# EasyEDA Pro project ProPrj_ch32v305_pico.epro, schematic 40low_CH32V305_KS33_4

## Sheets
1 Keyboard: Board Name: 40low_CH32V305_RightWing; Create Date: 2026-09-10; Page Name: Keyboard; Project Name: #第11届立创电赛#CH32V305 pico USBHS开发板; Schematic Name: 40low_CH32V305_KS33_4; Update Date: 2026-09-10; Company: 嘉立创EDA; Page Size: A3; Version: V1.0
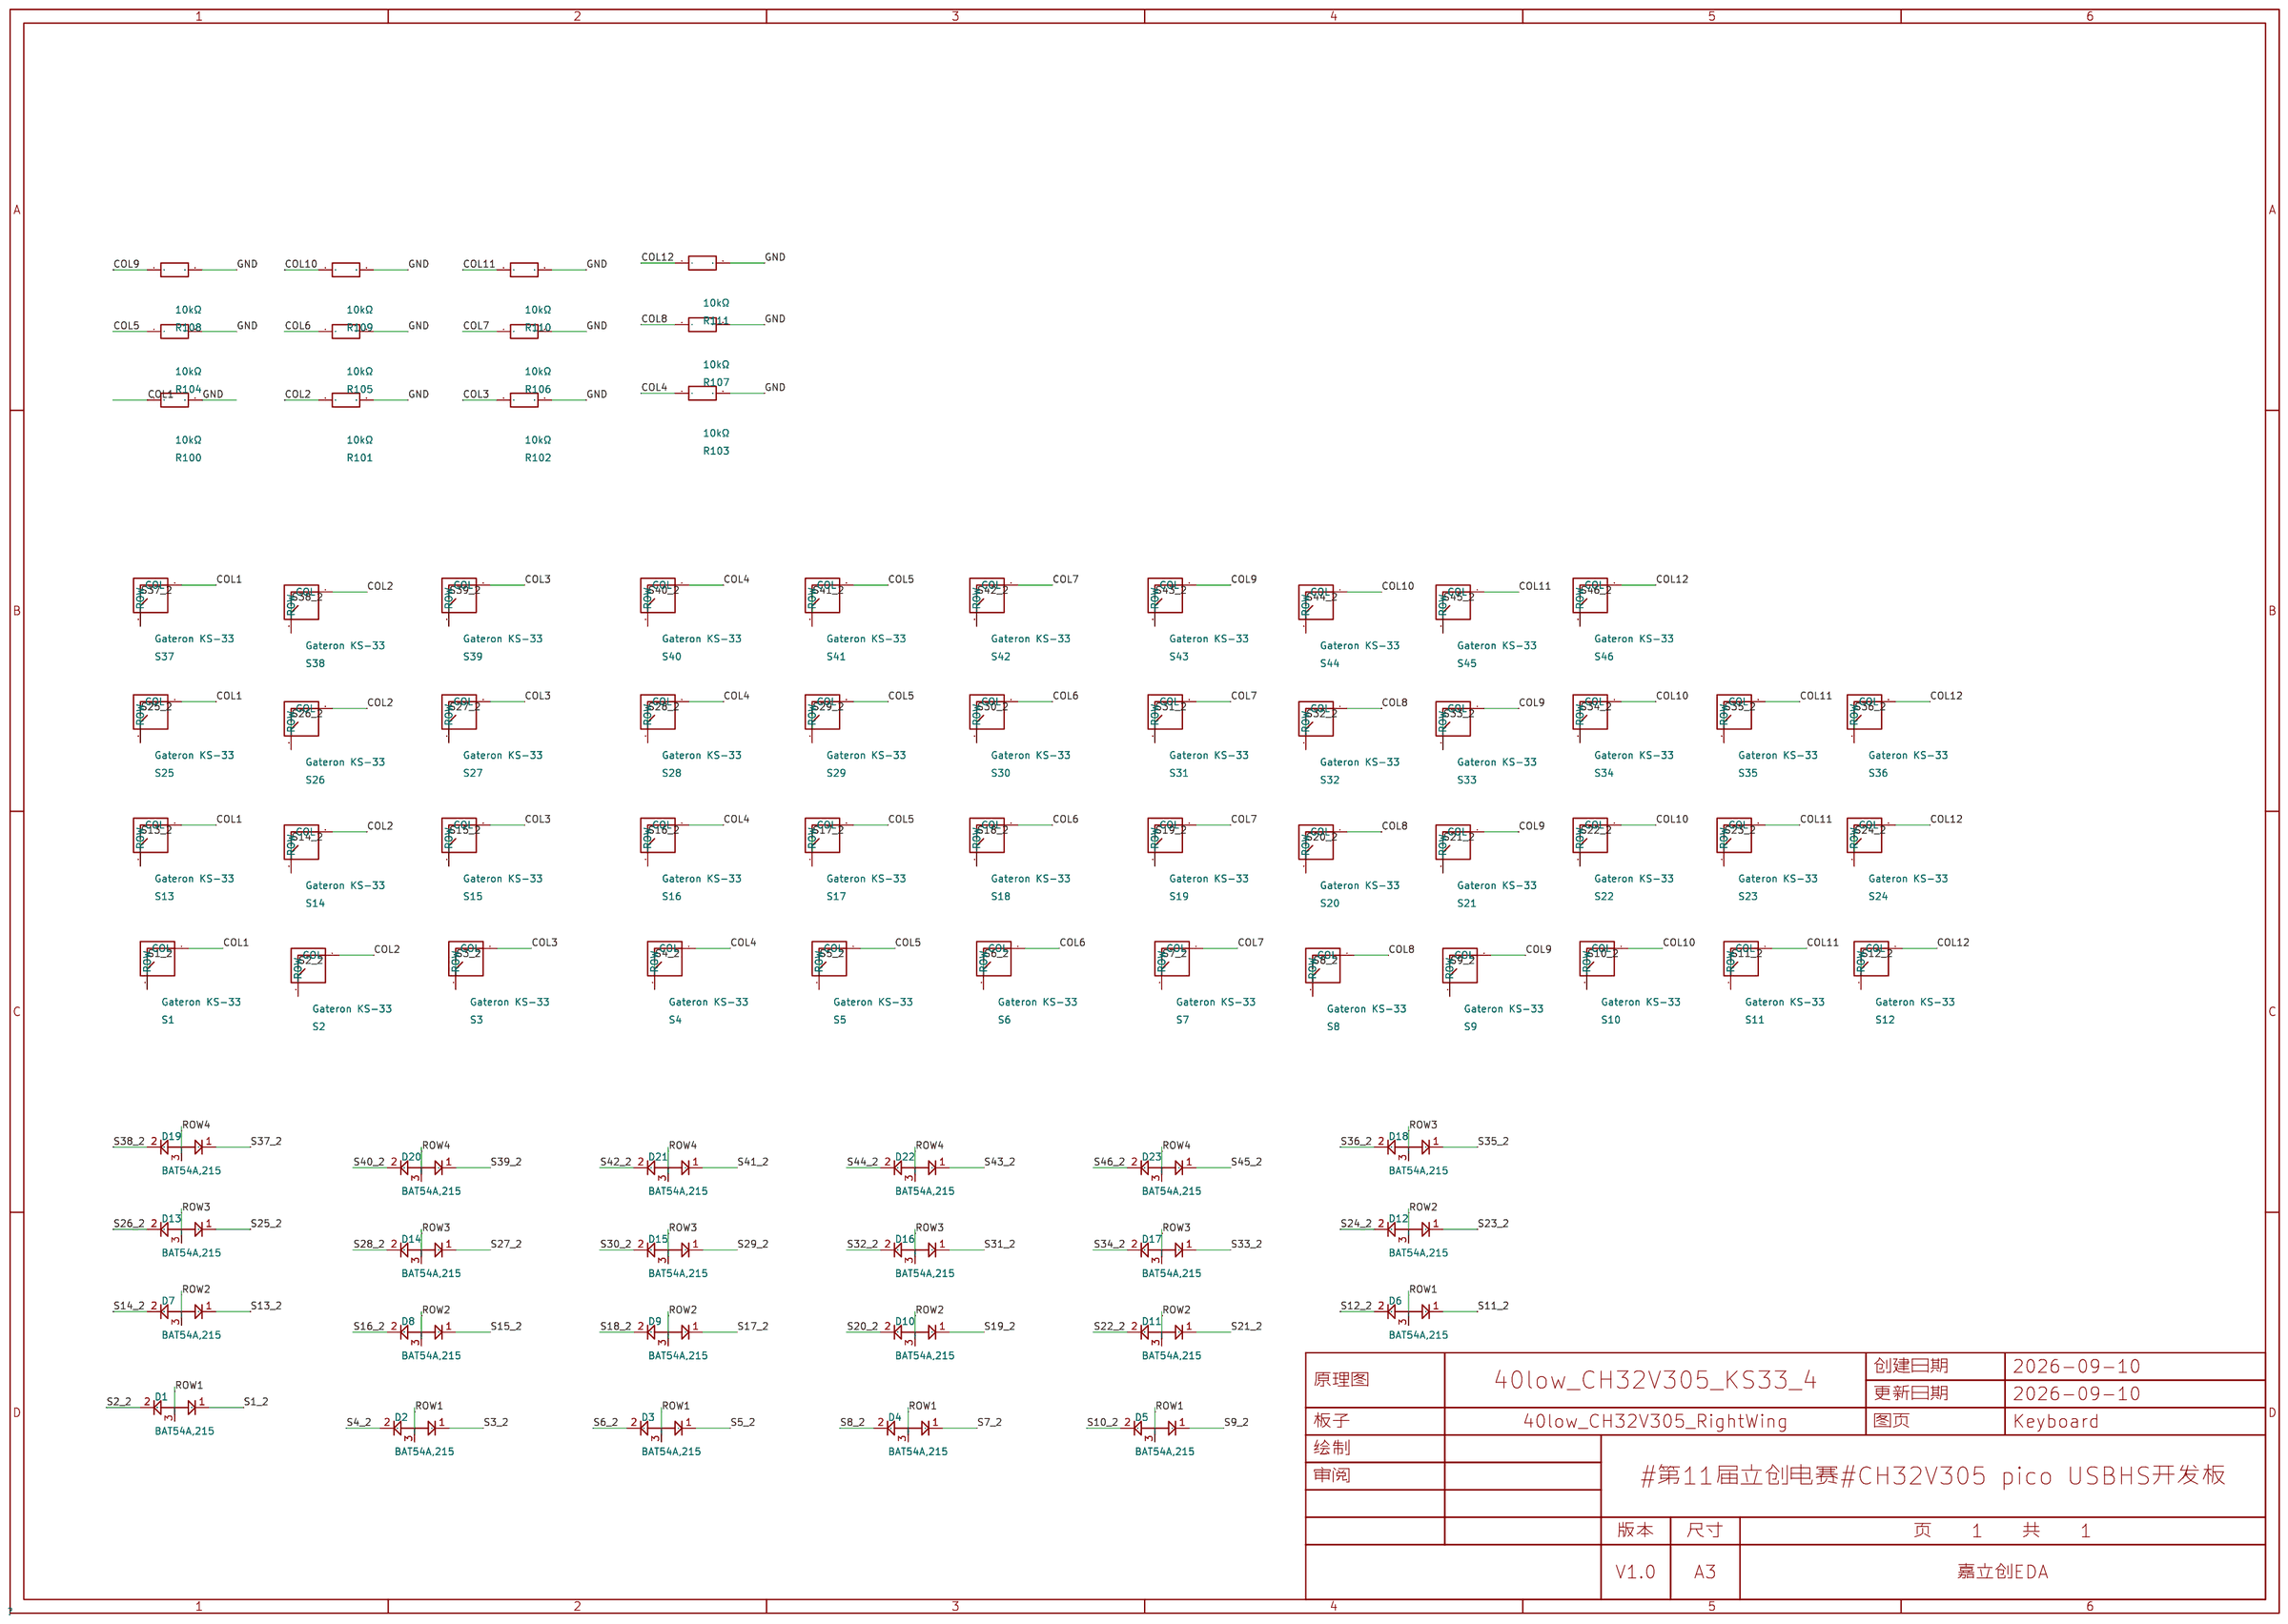
[diagram p0: Keyboard]
2 MCU: Assembly Variant: Basic; Page Name: P1; Page Size: A4
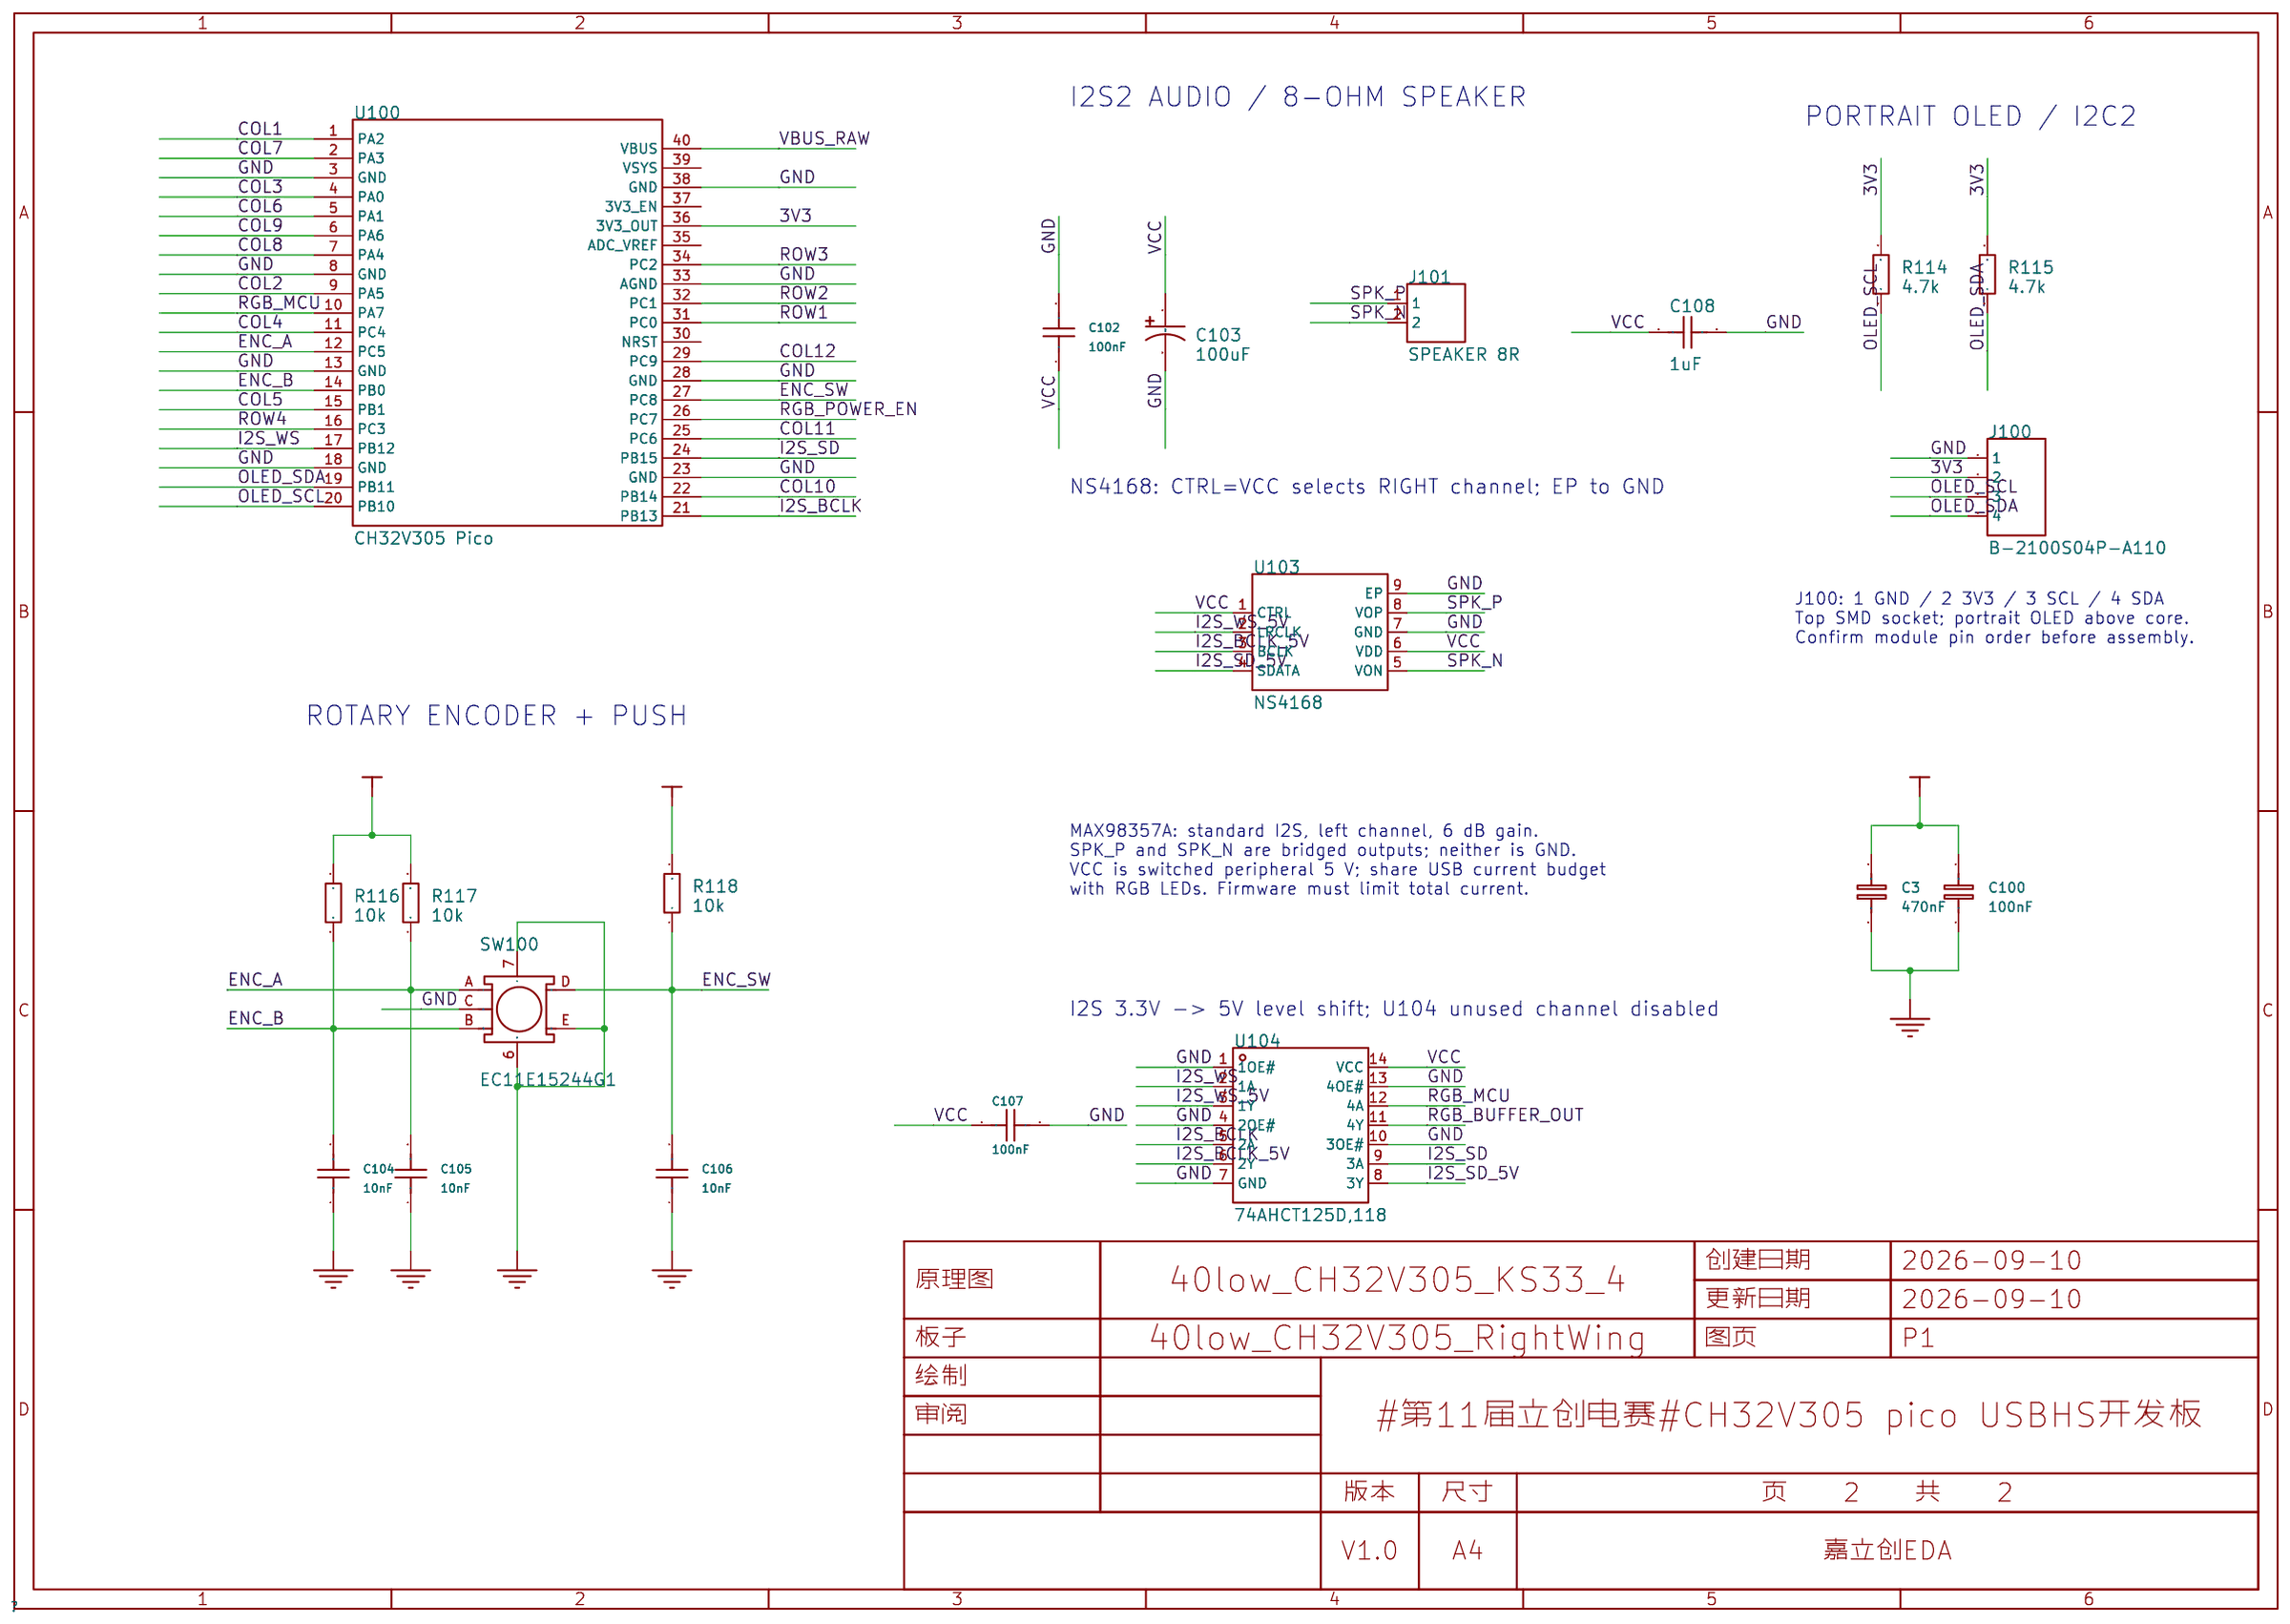
[diagram p1: MCU]
3 LED: Page Name: LED
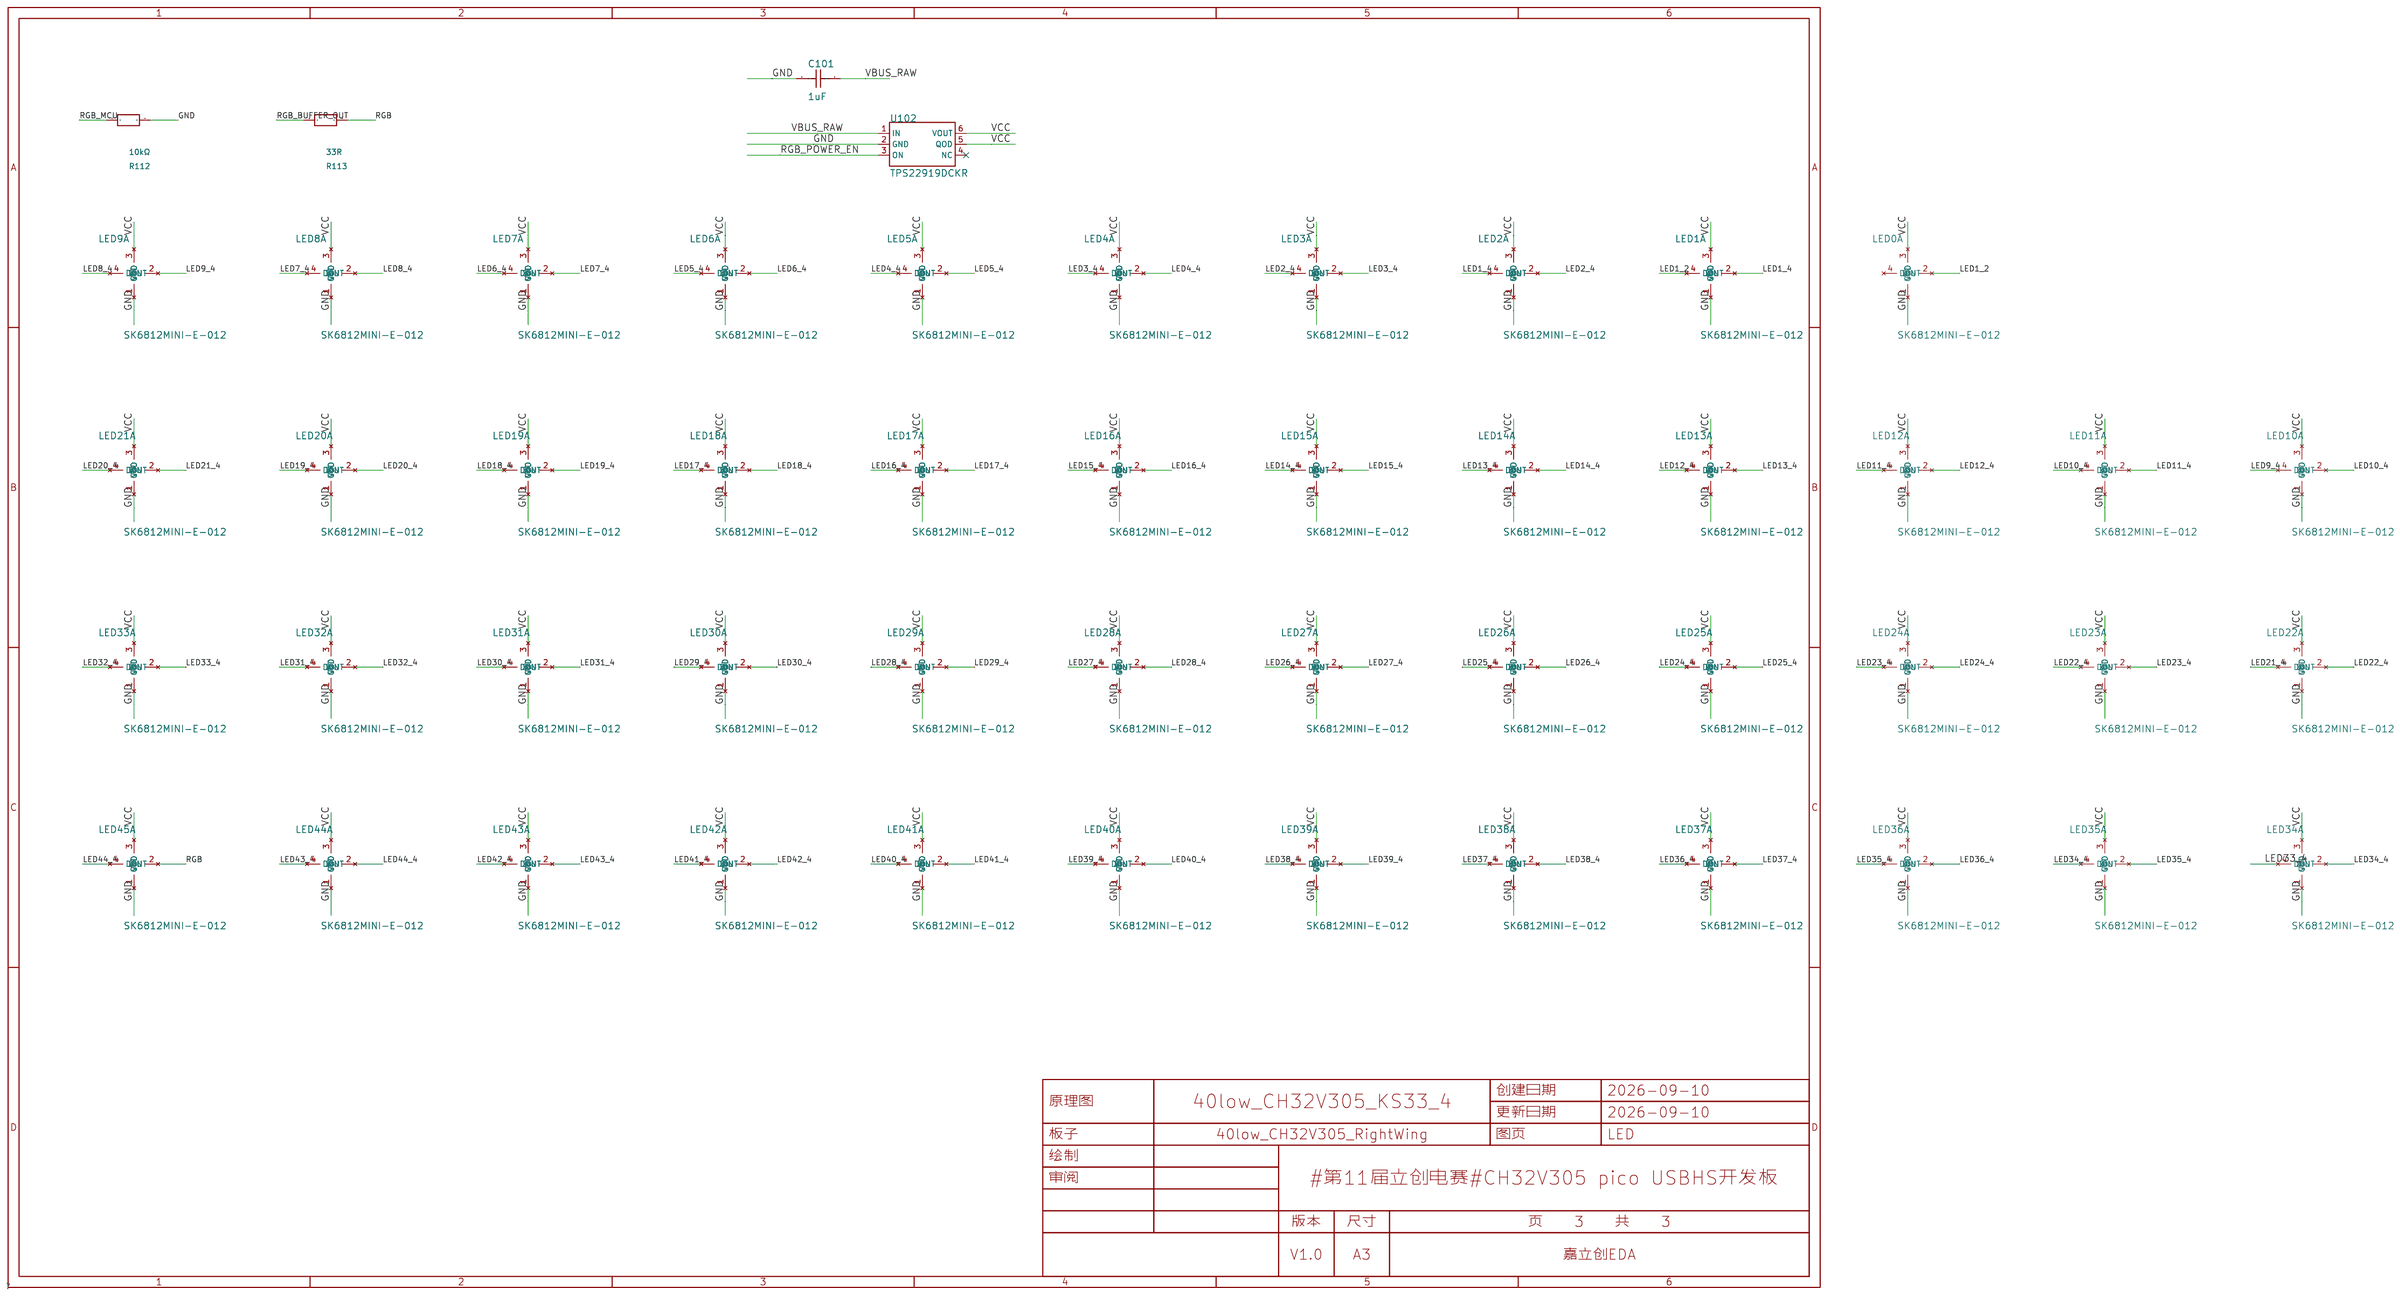
[diagram p2: LED]

## Parts
sheet Keyboard
D1  BAT54A,215  [SOT-23-3]
D2  BAT54A,215  [SOT-23-3]
D3  BAT54A,215  [SOT-23-3]
D4  BAT54A,215  [SOT-23-3]
D5  BAT54A,215  [SOT-23-3]
D6  BAT54A,215  [SOT-23-3]
D7  BAT54A,215  [SOT-23-3]
D8  BAT54A,215  [SOT-23-3]
D9  BAT54A,215  [SOT-23-3]
D10  BAT54A,215  [SOT-23-3]
D11  BAT54A,215  [SOT-23-3]
D12  BAT54A,215  [SOT-23-3]
D13  BAT54A,215  [SOT-23-3]
D14  BAT54A,215  [SOT-23-3]
D15  BAT54A,215  [SOT-23-3]
D16  BAT54A,215  [SOT-23-3]
D17  BAT54A,215  [SOT-23-3]
D18  BAT54A,215  [SOT-23-3]
D19  BAT54A,215  [SOT-23-3]
D20  BAT54A,215  [SOT-23-3]
D21  BAT54A,215  [SOT-23-3]
D22  BAT54A,215  [SOT-23-3]
D23  BAT54A,215  [SOT-23-3]
R100  10kΩ  [R0603]
R101  10kΩ  [R0603]
R102  10kΩ  [R0603]
R103  10kΩ  [R0603]
R104  10kΩ  [R0603]
R105  10kΩ  [R0603]
R106  10kΩ  [R0603]
R107  10kΩ  [R0603]
R108  10kΩ  [R0603]
R109  10kΩ  [R0603]
R110  10kΩ  [R0603]
R111  10kΩ  [R0603]
S1  Gateron KS-33  [40low_KS33_Solder_KeepCentre6p1]
S2  Gateron KS-33  [40low_KS33_Solder_KeepCentre6p1]
S3  Gateron KS-33  [40low_KS33_Solder_KeepCentre6p1]
S4  Gateron KS-33  [40low_KS33_Solder_KeepCentre6p1]
S5  Gateron KS-33  [40low_KS33_Solder_KeepCentre6p1]
S6  Gateron KS-33  [40low_KS33_Solder_KeepCentre6p1]
S7  Gateron KS-33  [40low_KS33_Solder_KeepCentre6p1]
S8  Gateron KS-33  [40low_KS33_Solder_KeepCentre6p1]
S9  Gateron KS-33  [40low_KS33_Solder_KeepCentre6p1]
S10  Gateron KS-33  [40low_KS33_Solder_KeepCentre6p1]
S11  Gateron KS-33  [40low_KS33_Solder_KeepCentre6p1]
S12  Gateron KS-33  [40low_KS33_Solder_KeepCentre6p1]
S13  Gateron KS-33  [40low_KS33_Solder_KeepCentre6p1]
S14  Gateron KS-33  [40low_KS33_Solder_KeepCentre6p1]
S15  Gateron KS-33  [40low_KS33_Solder_KeepCentre6p1]
S16  Gateron KS-33  [40low_KS33_Solder_KeepCentre6p1]
S17  Gateron KS-33  [40low_KS33_Solder_KeepCentre6p1]
S18  Gateron KS-33  [40low_KS33_Solder_KeepCentre6p1]
S19  Gateron KS-33  [40low_KS33_Solder_KeepCentre6p1]
S20  Gateron KS-33  [40low_KS33_Solder_KeepCentre6p1]
S21  Gateron KS-33  [40low_KS33_Solder_KeepCentre6p1]
S22  Gateron KS-33  [40low_KS33_Solder_KeepCentre6p1]
S23  Gateron KS-33  [40low_KS33_Solder_KeepCentre6p1]
S24  Gateron KS-33  [40low_KS33_Solder_KeepCentre6p1]
S25  Gateron KS-33  [40low_KS33_Solder_KeepCentre6p1]
S26  Gateron KS-33  [40low_KS33_Solder_KeepCentre6p1]
S27  Gateron KS-33  [40low_KS33_Solder_KeepCentre6p1]
S28  Gateron KS-33  [40low_KS33_Solder_KeepCentre6p1]
S29  Gateron KS-33  [40low_KS33_Solder_KeepCentre6p1]
S30  Gateron KS-33  [40low_KS33_Solder_KeepCentre6p1]
S31  Gateron KS-33  [40low_KS33_Solder_KeepCentre6p1]
S32  Gateron KS-33  [40low_KS33_Solder_KeepCentre6p1]
S33  Gateron KS-33  [40low_KS33_Solder_KeepCentre6p1]
S34  Gateron KS-33  [40low_KS33_Solder_KeepCentre6p1]
S35  Gateron KS-33  [40low_KS33_Solder_KeepCentre6p1]
S36  Gateron KS-33  [40low_KS33_Solder_KeepCentre6p1]
S37  Gateron KS-33  [40low_KS33_Solder_KeepCentre6p1]
S38  Gateron KS-33  [40low_KS33_Solder_KeepCentre6p1]
S39  Gateron KS-33  [40low_KS33_Solder_KeepCentre6p1]
S40  Gateron KS-33  [40low_KS33_Solder_KeepCentre6p1]
S41  Gateron KS-33  [40low_KS33_Solder_KeepCentre6p1]
S42  Gateron KS-33  [40low_KS33_Solder_KeepCentre6p1]
S43  Gateron KS-33  [40low_KS33_Solder_KeepCentre6p1]
S44  Gateron KS-33  [40low_KS33_Solder_KeepCentre6p1]
S45  Gateron KS-33  [40low_KS33_Solder_KeepCentre6p1]
S46  Gateron KS-33  [40low_KS33_Solder_KeepCentre6p1]
sheet LED
C101  1uF  [C0603]
LED0  SK6812MINI-E-012  [reverse-led-candidate]  (section 1)
LED1  SK6812MINI-E-012  [reverse-led-candidate]  (section 1)
LED2  SK6812MINI-E-012  [reverse-led-candidate]  (section 1)
LED3  SK6812MINI-E-012  [reverse-led-candidate]  (section 1)
LED4  SK6812MINI-E-012  [reverse-led-candidate]  (section 1)
LED5  SK6812MINI-E-012  [reverse-led-candidate]  (section 1)
LED6  SK6812MINI-E-012  [reverse-led-candidate]  (section 1)
LED7  SK6812MINI-E-012  [reverse-led-candidate]  (section 1)
LED8  SK6812MINI-E-012  [reverse-led-candidate]  (section 1)
LED9  SK6812MINI-E-012  [reverse-led-candidate]  (section 1)
LED10  SK6812MINI-E-012  [reverse-led-candidate]  (section 1)
LED11  SK6812MINI-E-012  [reverse-led-candidate]  (section 1)
LED12  SK6812MINI-E-012  [reverse-led-candidate]  (section 1)
LED13  SK6812MINI-E-012  [reverse-led-candidate]  (section 1)
LED14  SK6812MINI-E-012  [reverse-led-candidate]  (section 1)
LED15  SK6812MINI-E-012  [reverse-led-candidate]  (section 1)
LED16  SK6812MINI-E-012  [reverse-led-candidate]  (section 1)
LED17  SK6812MINI-E-012  [reverse-led-candidate]  (section 1)
LED18  SK6812MINI-E-012  [reverse-led-candidate]  (section 1)
LED19  SK6812MINI-E-012  [reverse-led-candidate]  (section 1)
LED20  SK6812MINI-E-012  [reverse-led-candidate]  (section 1)
LED21  SK6812MINI-E-012  [reverse-led-candidate]  (section 1)
LED22  SK6812MINI-E-012  [reverse-led-candidate]  (section 1)
LED23  SK6812MINI-E-012  [reverse-led-candidate]  (section 1)
LED24  SK6812MINI-E-012  [reverse-led-candidate]  (section 1)
LED25  SK6812MINI-E-012  [reverse-led-candidate]  (section 1)
LED26  SK6812MINI-E-012  [reverse-led-candidate]  (section 1)
LED27  SK6812MINI-E-012  [reverse-led-candidate]  (section 1)
LED28  SK6812MINI-E-012  [reverse-led-candidate]  (section 1)
LED29  SK6812MINI-E-012  [reverse-led-candidate]  (section 1)
LED30  SK6812MINI-E-012  [reverse-led-candidate]  (section 1)
LED31  SK6812MINI-E-012  [reverse-led-candidate]  (section 1)
LED32  SK6812MINI-E-012  [reverse-led-candidate]  (section 1)
LED33  SK6812MINI-E-012  [reverse-led-candidate]  (section 1)
LED34  SK6812MINI-E-012  [reverse-led-candidate]  (section 1)
LED35  SK6812MINI-E-012  [reverse-led-candidate]  (section 1)
LED36  SK6812MINI-E-012  [reverse-led-candidate]  (section 1)
LED37  SK6812MINI-E-012  [reverse-led-candidate]  (section 1)
LED38  SK6812MINI-E-012  [reverse-led-candidate]  (section 1)
LED39  SK6812MINI-E-012  [reverse-led-candidate]  (section 1)
LED40  SK6812MINI-E-012  [reverse-led-candidate]  (section 1)
LED41  SK6812MINI-E-012  [reverse-led-candidate]  (section 1)
LED42  SK6812MINI-E-012  [reverse-led-candidate]  (section 1)
LED43  SK6812MINI-E-012  [reverse-led-candidate]  (section 1)
LED44  SK6812MINI-E-012  [reverse-led-candidate]  (section 1)
LED45  SK6812MINI-E-012  [reverse-led-candidate]  (section 1)
R112  10kΩ  [R0603]
R113  33R  [0603]
U102  TPS22919DCKR  [SC-70-6_L2.2-W1.3-P0.65-LS2.1-BR]
sheet MCU
C3  470nF  [C0603]
C100  100nF  [C0603]
C102  100nF  [C0603]
C103  100uF  [CAP-SMD_BD5.0-L5.3-W5.3-LS6.3-FD]
C104  10nF  [C0603]
C105  10nF  [C0603]
C106  10nF  [C0603]
C107  100nF  [C0603]
C108  1uF  [C0603]
J100  B-2100S04P-A110  [HDR-TH_4P-P2.54-V-M]
J101  SPEAKER 8R  [HDR-TH_2P-P2.54-V-M-1]
R114  4.7kΩ  [R0603]
R115  4.7kΩ  [R0603]
R116  10kΩ  [R0603]
R117  10kΩ  [R0603]
R118  10kΩ  [R0603]
SW100  EC11E15244G1  [SW-TH_EC11E15244G1]
U100  CH32V305 Pico  [CH32V305_Pico_Castellated_40]
U103  NS4168  [ESOP-8_L4.9-W3.9-P1.27-LS6.0-BL-EP]
U104  74AHCT125D,118  [SOP-14_L8.6-W3.9-P1.27-LS6.0-BL]

## Library data of the parts
D1-D23 = MMBD4148: Dual common-anode Schottky diode; pin 3 A1/A2, pin 1 K1, pin 2 K2; SOT-23; Origin 3D Model Title: SOT-23-3L_L2.9-W1.6-H1.1-LS2.8-P0.95; Manufacturer: Nexperia(安世); Supplier: LCSC; Supplier Part: C130910; Datasheet: https://assets.nexperia.com/documents/data-sheet/BAT54A.pdf
R100-R112 R116-R118 = 0603WAF1002T5E: 电阻类型:厚膜电阻;阻值:10kΩ;精度:±1%;功率:100mW;工作电压:75V;温度系数:±100ppm/℃;; LCSC Part Name: 厚膜电阻 10kΩ ±1% 100mW; Supplier Part: C25804; Manufacturer: UNI-ROYAL(厚声); Supplier Footprint: 0603; JLCPCB Part Class: Basic Part; Datasheet: https://item.szlcsc.com/datasheet/0603WAF1002T5E/26547.html; Supplier: LCSC; Type: 厚膜电阻; Tolerance: ±1%; Power(Watts): 100mW; Voltage-Supply(Max): 75V; Temperature Coefficient: ±100ppm/℃; Operating Temperature: -55℃~+155℃
S1-S46 = Gateron KS-33 solder (40low)
C101 C108 = CL10A105KB8NNNC: 容值:1uF;精度:±10%;额定电压:50V;温度系数:X5R;; LCSC Part Name: 1uF ±10% 50V; Supplier Part: C15849; Manufacturer: SAMSUNG(三星); Supplier Footprint: 0603; JLCPCB Part Class: Basic Part; Datasheet: https://item.szlcsc.com/datasheet/CL10A105KB8NNNC/16531.html; Supplier: LCSC; Tolerance: ±10%; Voltage Rating: 50V; Temperature Coefficient: X5R
LED0-LED45 = SK6812MINI_E_012_40low: OPSCO SK6812MINI-E-012 reverse LED; 1 GND, 2 DIN, 3 VDD, 4 DOUT; Manufacturer: OPSCO; Supplier: LCSC; Supplier Part: C5149201
R113 = 33R 0603: 0603 generic; choose matching rated part before BOM release.
U102 = TPS22919DCKR: 类型:负载开关;通道数:1;输入控制逻辑:高电平有效;最大连续电流:1.5A;工作电压:1.6V~5.5V;导通电阻:89mΩ;; LCSC Part Name: 具有受控上升时间的5.5V、1.5A、90mΩ自保护负载开关; Supplier Part: C2149796; Manufacturer: Texas Instruments; Supplier Footprint: SC-70-6; JLCPCB Part Class: Extended Part; Datasheet: https://www.ti.com/cn/lit/gpn/tps22919; Supplier: LCSC; Type: 负载开关; Number of Channels: 1; Control Input Logic: 高电平有效; Maximum Continuous Current: 1.5A; Voltage - Supply: 1.6V~5.5V; RDS(on): 89mΩ; Operating Temperature	-: -40℃~+125℃; Features: 过热保护(OTP)；短路保护(SCP)
C3 = CL10B474KO8NNNC: 容值:470nF;精度:±10%;额定电压:16V;温度系数:X7R;; LCSC Part Name: 470nF ±10% 16V; Supplier Part: C105526; Manufacturer: SAMSUNG(三星); Supplier Footprint: 0603; JLCPCB Part Class: Extended Part; Datasheet: https://item.szlcsc.com/datasheet/CL10B474KO8NNNC/106741.html; Supplier: LCSC; Tolerance: ±10%; Voltage Rating: 16V; Temperature Coefficient: X7R
C100 C102 C107 = CC0603KRX7R9BB104: 容值:100nF;精度:±10%;额定电压:50V;温度系数:X7R;; LCSC Part Name: 100nF ±10% 50V; Supplier Part: C14663; Manufacturer: YAGEO(国巨); Supplier Footprint: 0603; JLCPCB Part Class: Basic Part; Datasheet: https://item.szlcsc.com/datasheet/CC0603KRX7R9BB104/15331.html; Supplier: LCSC; Tolerance: ±10%; Voltage Rating: 50V; Temperature Coefficient: X7R
C103 = VT1A101M0505: 容值:100uF;精度:±20%;额定电压:10V;纹波电流:40mA@120Hz;等效串联电阻(ESR):-;; LCSC Part Name: 100uF ±20% 10V; Supplier Part: C191859; Manufacturer: ROQANG(容强); Supplier Footprint: SMD,D5xL5.4mm; JLCPCB Part Class: Extended Part; Datasheet: https://atta.szlcsc.com/upload/public/pdf/source/20180502/C191859_5B846418F1FC4C14CCCE0409874E2ED6.pdf; Supplier: LCSC; Tolerance: ±20%; Voltage Rating: 10V; Ripple Current: 40mA@120Hz; Diameter: 5mm; Height - Seated (Max): 5.4mm; Lifetime: 2000hrs@105℃; Operating Temperature: -40℃~+105℃
C104-C106 = 0603B103K500NT: 容值:10nF;精度:±10%;额定电压:50V;温度系数:X7R;; LCSC Part Name: 10nF ±10% 50V; Supplier Part: C57112; Manufacturer: FH(风华); Supplier Footprint: 0603; JLCPCB Part Class: Basic Part; Datasheet: https://item.szlcsc.com/datasheet/0603B103K500NT/58143.html; Supplier: LCSC; Tolerance: ±10%; Voltage Rating: 50V; Temperature Coefficient: X7R
J100 = B-2100S04P-A110: 插针结构:1x4P;间距:2.54mm;行距:-;圆针/方针:方针;安装方式:直插;排数:单排;总PIN位数:4P;额定电流:3A;额定电压:-;配合针长度:6mm;塑高:2.54mm;端接针长度:3mm;触头材质:黄铜;触头镀层:-;工作温度:-40℃~+105℃;颜色:黑色;; LCSC Part Name: 1x4P 间距:2.54mm 方针 直插; Supplier Part: C124378; Manufacturer: Ckmtw(灿科盟); Supplier Footprint: 插件,P=2.54mm; JLCPCB Part Class: Extended Part; Datasheet: https://item.szlcsc.com/datasheet/B-2100S04P-A110/125653.html; Supplier: LCSC; Pin Structure: 1x4P; Pitch: 2.54mm; Circluar Pins/Square Pins: 方针; Mounting Type: 直插; Number of Rows: 单排; Number of Pins: 4P; Current Rating: 3A; Length of Mating Pin: 6mm; Insulation Height: 2.54mm; Length of End Connection Pin: 3mm; Contact Material: 黄铜; Operating Temperature: -40℃~+105℃; Color: 黑色
J101 = B-2100S02P-A110: 插针结构:1x2P;间距:2.54mm;行距:-;圆针/方针:方针;安装方式:直插;排数:单排;总PIN位数:2P;额定电流:3A;额定电压:-;配合针长度:6mm;塑高:2.54mm;端接针长度:3mm;触头材质:黄铜;触头镀层:金;工作温度:-40℃~+105℃;颜色:黑色;; LCSC Part Name: 1x2P 间距:2.54mm 方针 直插; Supplier Part: C124375; Manufacturer: Ckmtw(灿科盟); Supplier Footprint: 插件,P=2.54mm; JLCPCB Part Class: Extended Part; Datasheet: https://item.szlcsc.com/datasheet/B-2100S02P-A110/125650.html; Supplier: LCSC; Pin Structure: 1x2P; Pitch: 2.54mm; Circluar Pins/Square Pins: 方针; Mounting Type: 直插; Number of Rows: 单排; Number of Pins: 2P; Current Rating: 3A; Length of Mating Pin: 6mm; Insulation Height: 2.54mm; Length of End Connection Pin: 3mm; Contact Material: 黄铜; Contact Plating: 金; Operating Temperature: -40℃~+105℃; Color: 黑色
R114 R115 = 0603WAF4701T5E: 电阻类型:厚膜电阻;阻值:4.7kΩ;精度:±1%;功率:100mW;工作电压:75V;温度系数:±100ppm/℃;; LCSC Part Name: 厚膜电阻 4.7kΩ ±1%; Supplier Part: C23162; Manufacturer: UNI-ROYAL(厚声); Supplier Footprint: 0603; JLCPCB Part Class: Basic Part; Datasheet: https://item.szlcsc.com/datasheet/0603WAF4701T5E/23889.html; Supplier: LCSC; Type: 厚膜电阻; Tolerance: ±1%; Power(Watts): 100mW; Voltage-Supply(Max): 75V; Temperature Coefficient: ±100ppm/℃; Operating Temperature: -55℃~+155℃
SW100 = EC11E15244G1: LCSC Part Name: 编码器; Supplier Part: C370970; Manufacturer: ALPSALPINE(阿尔卑斯阿尔派); Supplier Footprint: 插件; JLCPCB Part Class: Extended Part; Datasheet: https://item.szlcsc.com/datasheet/EC11E15244G1/344654.html; Supplier: LCSC
U100 = CH32V305_Pico_Castellated_40_Module: CH32V305 Pico revision 2, 40 castellated SMD carrier contacts; Supplier Part: 48c9595067e55f20
U103 = NS4168_C910588: 功放类型:D类功放;扬声器通道数:单声道;输出功率:2.5Wx1@4Ω;静态电流(Iq):13mA;; LCSC Part Name: 2.5W-I2S数字输入单声道D类音频功率放大器; Supplier Part: C910588; Manufacturer: Nsiway(纳芯威); Supplier Footprint: ESOP-8-EP(3.9x4.9x1.27); JLCPCB Part Class: Extended Part; Datasheet: https://item.szlcsc.com/datasheet/NS4168/978904.html; Supplier: LCSC; Class: D类功放; Speaker Channels: 单声道; Output Power: 2.5Wx1@4Ω; Total Harmonic Distortion + Noise (THD+N): 0.2%; Quiescent Current: 13mA; Signal-to-Noise Ratio: 85dB; Power Supply Rejection Ratio (PSRR): -80dB; Efficiency: 80%; Features: 无滤波器架构；使能/关断功能；自动静音/免噪音开关；内置音频处理；可配置输出拓扑; Voltage - Supply: 3V~5.5V
U104 = 74AHCT125D,118: 输入类型:施密特触发器;工作电压:4.5V~5.5V;元件数:4;每个元件位数:1;灌电流(IOL):8mA;拉电流(IOH):8mA;; LCSC Part Name: 三态输出，四路缓冲器/线路驱动器; Supplier Part: C554502; Manufacturer: Nexperia(安世); Supplier Footprint: SOP-14; JLCPCB Part Class: Extended Part; Datasheet: https://item.szlcsc.com/datasheet/74AHCT125D%252C118/575616.html; Supplier: LCSC; Input type: 施密特触发器; output type: 三态; Voltage - Supply: 4.5V~5.5V; Number of Elements: 4; Number of Bits per Element: 1; Channel Type: 单向; Current - Output Low(IOL): 8mA; Current - Output High(IOH): 8mA; Logic Family: 74AHCT; Operating Temperature: -40℃~+125℃; Quiescent Current: 40uA; Propagation Delay: 4.3ns@5V,50pF

## Nets
3V3: J100.2 R114.2 R115.2 R116.1 R117.2 R118.2 U100.36(3V3_OUT)
GND: C3.2 C100.2 C101.1 C102.2 C103.2 C104.1 C105.1 C106.1 C107.2 C108.2 J100.1 LED0.1(GND) LED1.1(GND) LED2.1(GND) LED3.1(GND) LED4.1(GND) LED5.1(GND) LED6.1(GND) LED7.1(GND) LED8.1(GND) LED9.1(GND) LED10.1(GND) LED11.1(GND) LED12.1(GND) LED13.1(GND) LED14.1(GND) LED15.1(GND) LED16.1(GND) LED17.1(GND) LED18.1(GND) LED19.1(GND) LED20.1(GND) LED21.1(GND) LED22.1(GND) LED23.1(GND) LED24.1(GND) LED25.1(GND) LED26.1(GND) LED27.1(GND) LED28.1(GND) LED29.1(GND) LED30.1(GND) LED31.1(GND) LED32.1(GND) LED33.1(GND) LED34.1(GND) LED35.1(GND) LED36.1(GND) LED37.1(GND) LED38.1(GND) LED39.1(GND) LED40.1(GND) LED41.1(GND) LED42.1(GND) LED43.1(GND) LED44.1(GND) LED45.1(GND) R100.2 R101.2 R102.2 R103.2 R104.2 R105.2 R106.2 R107.2 R108.2 R109.2 R110.2 R111.2 R112.2 SW100.6 SW100.7 SW100.C SW100.E U100.3(GND) U100.8(GND) U100.13(GND) U100.18(GND) U100.23(GND) U100.28(GND) U100.33(AGND) U100.38(GND) U102.2(GND) U103.7(GND) U103.9(EP) U104.1(1OE#) U104.4(2OE#) U104.7(GND) U104.10(3OE#) U104.13(4OE#)
VBUS_RAW: C101.2 U100.40(VBUS) U102.1(IN)
VCC: C3.1 C100.1 C102.1 C103.1 C107.1 C108.1 LED0.3(VDD) LED1.3(VDD) LED2.3(VDD) LED3.3(VDD) LED4.3(VDD) LED5.3(VDD) LED6.3(VDD) LED7.3(VDD) LED8.3(VDD) LED9.3(VDD) LED10.3(VDD) LED11.3(VDD) LED12.3(VDD) LED13.3(VDD) LED14.3(VDD) LED15.3(VDD) LED16.3(VDD) LED17.3(VDD) LED18.3(VDD) LED19.3(VDD) LED20.3(VDD) LED21.3(VDD) LED22.3(VDD) LED23.3(VDD) LED24.3(VDD) LED25.3(VDD) LED26.3(VDD) LED27.3(VDD) LED28.3(VDD) LED29.3(VDD) LED30.3(VDD) LED31.3(VDD) LED32.3(VDD) LED33.3(VDD) LED34.3(VDD) LED35.3(VDD) LED36.3(VDD) LED37.3(VDD) LED38.3(VDD) LED39.3(VDD) LED40.3(VDD) LED41.3(VDD) LED42.3(VDD) LED43.3(VDD) LED44.3(VDD) LED45.3(VDD) U102.5(QOD) U102.6(VOUT) U103.1(CTRL) U103.6(VDD) U104.14(VCC)
COL1: R100.1 S1.1(COL) S13.1(COL) S25.1(COL) S37.1(COL) U100.1(PA2)
COL2: R101.1 S2.1(COL) S14.1(COL) S26.1(COL) S38.1(COL) U100.9(PA5)
COL3: R102.1 S3.1(COL) S15.1(COL) S27.1(COL) S39.1(COL) U100.4(PA0)
COL4: R103.1 S4.1(COL) S16.1(COL) S28.1(COL) S40.1(COL) U100.11(PC4)
COL5: R104.1 S5.1(COL) S17.1(COL) S29.1(COL) S41.1(COL) U100.15(PB1)
COL6: R105.1 S6.1(COL) S18.1(COL) S30.1(COL) U100.5(PA1)
COL7: R106.1 S7.1(COL) S19.1(COL) S31.1(COL) S42.1(COL) U100.2(PA3)
COL8: R107.1 S8.1(COL) S20.1(COL) S32.1(COL) U100.7(PA4)
COL9: R108.1 S9.1(COL) S21.1(COL) S33.1(COL) S43.1(COL) U100.6(PA6)
COL10: R109.1 S10.1(COL) S22.1(COL) S34.1(COL) S44.1(COL) U100.22(PB14)
COL11: R110.1 S11.1(COL) S23.1(COL) S35.1(COL) S45.1(COL) U100.25(PC6)
COL12: R111.1 S12.1(COL) S24.1(COL) S36.1(COL) S46.1(COL) U100.29(PC9)
ENC_A: C105.2 R117.1 SW100.A U100.12(PC5)
ENC_B: C104.2 R116.2 SW100.B U100.14(PB0)
ENC_SW: C106.2 R118.1 SW100.D U100.27(PC8)
I2S_BCLK: U100.21(PB13) U104.5(2A)
I2S_BCLK_5V: U103.3(BCLK) U104.6(2Y)
I2S_SD: U100.24(PB15) U104.9(3A)
I2S_SD_5V: U103.4(SDATA) U104.8(3Y)
I2S_WS: U100.17(PB12) U104.2(1A)
I2S_WS_5V: U103.2(LRCLK) U104.3(1Y)
LED1_2: LED0.2(DIN) LED1.4(DOUT)
LED1_4: LED1.2(DIN) LED2.4(DOUT)
LED2_4: LED2.2(DIN) LED3.4(DOUT)
LED3_4: LED3.2(DIN) LED4.4(DOUT)
LED4_4: LED4.2(DIN) LED5.4(DOUT)
LED5_4: LED5.2(DIN) LED6.4(DOUT)
LED6_4: LED6.2(DIN) LED7.4(DOUT)
LED7_4: LED7.2(DIN) LED8.4(DOUT)
LED8_4: LED8.2(DIN) LED9.4(DOUT)
LED9_4: LED9.2(DIN) LED10.4(DOUT)
LED10_4: LED10.2(DIN) LED11.4(DOUT)
LED11_4: LED11.2(DIN) LED12.4(DOUT)
LED12_4: LED12.2(DIN) LED13.4(DOUT)
LED13_4: LED13.2(DIN) LED14.4(DOUT)
LED14_4: LED14.2(DIN) LED15.4(DOUT)
LED15_4: LED15.2(DIN) LED16.4(DOUT)
LED16_4: LED16.2(DIN) LED17.4(DOUT)
LED17_4: LED17.2(DIN) LED18.4(DOUT)
LED18_4: LED18.2(DIN) LED19.4(DOUT)
LED19_4: LED19.2(DIN) LED20.4(DOUT)
LED20_4: LED20.2(DIN) LED21.4(DOUT)
LED21_4: LED21.2(DIN) LED22.4(DOUT)
LED22_4: LED22.2(DIN) LED23.4(DOUT)
LED23_4: LED23.2(DIN) LED24.4(DOUT)
LED24_4: LED24.2(DIN) LED25.4(DOUT)
LED25_4: LED25.2(DIN) LED26.4(DOUT)
LED26_4: LED26.2(DIN) LED27.4(DOUT)
LED27_4: LED27.2(DIN) LED28.4(DOUT)
LED28_4: LED28.2(DIN) LED29.4(DOUT)
LED29_4: LED29.2(DIN) LED30.4(DOUT)
LED30_4: LED30.2(DIN) LED31.4(DOUT)
LED31_4: LED31.2(DIN) LED32.4(DOUT)
LED32_4: LED32.2(DIN) LED33.4(DOUT)
LED33_4: LED33.2(DIN) LED34.4(DOUT)
LED34_4: LED34.2(DIN) LED35.4(DOUT)
LED35_4: LED35.2(DIN) LED36.4(DOUT)
LED36_4: LED36.2(DIN) LED37.4(DOUT)
LED37_4: LED37.2(DIN) LED38.4(DOUT)
LED38_4: LED38.2(DIN) LED39.4(DOUT)
LED39_4: LED39.2(DIN) LED40.4(DOUT)
LED40_4: LED40.2(DIN) LED41.4(DOUT)
LED41_4: LED41.2(DIN) LED42.4(DOUT)
LED42_4: LED42.2(DIN) LED43.4(DOUT)
LED43_4: LED43.2(DIN) LED44.4(DOUT)
LED44_4: LED44.2(DIN) LED45.4(DOUT)
OLED_SCL: J100.3 R114.1 U100.20(PB10)
OLED_SDA: J100.4 R115.1 U100.19(PB11)
RGB: LED45.2(DIN) R113.2
RGB_BUFFER_OUT: R113.1 U104.11(4Y)
RGB_MCU: R112.1 U100.10(PA7) U104.12(4A)
RGB_POWER_EN: U100.26(PC7) U102.3(ON)
ROW1: D1.3 D2.3 D3.3 D4.3 D5.3 D6.3 U100.31(PC0)
ROW2: D7.3 D8.3 D9.3 D10.3 D11.3 D12.3 U100.32(PC1)
ROW3: D13.3 D14.3 D15.3 D16.3 D17.3 D18.3 U100.34(PC2)
ROW4: D19.3 D20.3 D21.3 D22.3 D23.3 U100.16(PC3)
S1_2: D1.1 S1.2(ROW)
S2_2: D1.2 S2.2(ROW)
S3_2: D2.1 S3.2(ROW)
S4_2: D2.2 S4.2(ROW)
S5_2: D3.1 S5.2(ROW)
S6_2: D3.2 S6.2(ROW)
S7_2: D4.1 S7.2(ROW)
S8_2: D4.2 S8.2(ROW)
S9_2: D5.1 S9.2(ROW)
S10_2: D5.2 S10.2(ROW)
S11_2: D6.1 S11.2(ROW)
S12_2: D6.2 S12.2(ROW)
S13_2: D7.1 S13.2(ROW)
S14_2: D7.2 S14.2(ROW)
S15_2: D8.1 S15.2(ROW)
S16_2: D8.2 S16.2(ROW)
S17_2: D9.1 S17.2(ROW)
S18_2: D9.2 S18.2(ROW)
S19_2: D10.1 S19.2(ROW)
S20_2: D10.2 S20.2(ROW)
S21_2: D11.1 S21.2(ROW)
S22_2: D11.2 S22.2(ROW)
S23_2: D12.1 S23.2(ROW)
S24_2: D12.2 S24.2(ROW)
S25_2: D13.1 S25.2(ROW)
S26_2: D13.2 S26.2(ROW)
S27_2: D14.1 S27.2(ROW)
S28_2: D14.2 S28.2(ROW)
S29_2: D15.1 S29.2(ROW)
S30_2: D15.2 S30.2(ROW)
S31_2: D16.1 S31.2(ROW)
S32_2: D16.2 S32.2(ROW)
S33_2: D17.1 S33.2(ROW)
S34_2: D17.2 S34.2(ROW)
S35_2: D18.1 S35.2(ROW)
S36_2: D18.2 S36.2(ROW)
S37_2: D19.1 S37.2(ROW)
S38_2: D19.2 S38.2(ROW)
S39_2: D20.1 S39.2(ROW)
S40_2: D20.2 S40.2(ROW)
S41_2: D21.1 S41.2(ROW)
S42_2: D21.2 S42.2(ROW)
S43_2: D22.1 S43.2(ROW)
S44_2: D22.2 S44.2(ROW)
S45_2: D23.1 S45.2(ROW)
S46_2: D23.2 S46.2(ROW)
SPK_N: J101.2 U103.5(VON)
SPK_P: J101.1 U103.8(VOP)

Not connected (* = marked no-connect by the designer): LED0 4(DOUT); U100 30(NRST) 35(ADC_VREF) 37(3V3_EN) 39(VSYS); U102 4(NC)*

## Notes on the sheets
sheet 2
- I2S2 AUDIO / 8-OHM SPEAKER
- PORTRAIT OLED / I2C2
- NS4168: CTRL=VCC selects RIGHT channel; EP to GND
- J100: 1 GND / 2 3V3 / 3 SCL / 4 SDA
  Top SMD socket; portrait OLED above core.
  Confirm module pin order before assembly.
- ROTARY ENCODER + PUSH
- MAX98357A: standard I2S, left channel, 6 dB gain.
  SPK_P and SPK_N are bridged outputs; neither is GND.
  VCC is switched peripheral 5 V; share USB current budget
  with RGB LEDs. Firmware must limit total current.
- I2S 3.3V -> 5V level shift; U104 unused channel disabled
